# EAGLE schematic T08-TxClicker (EAGLE 6.4)
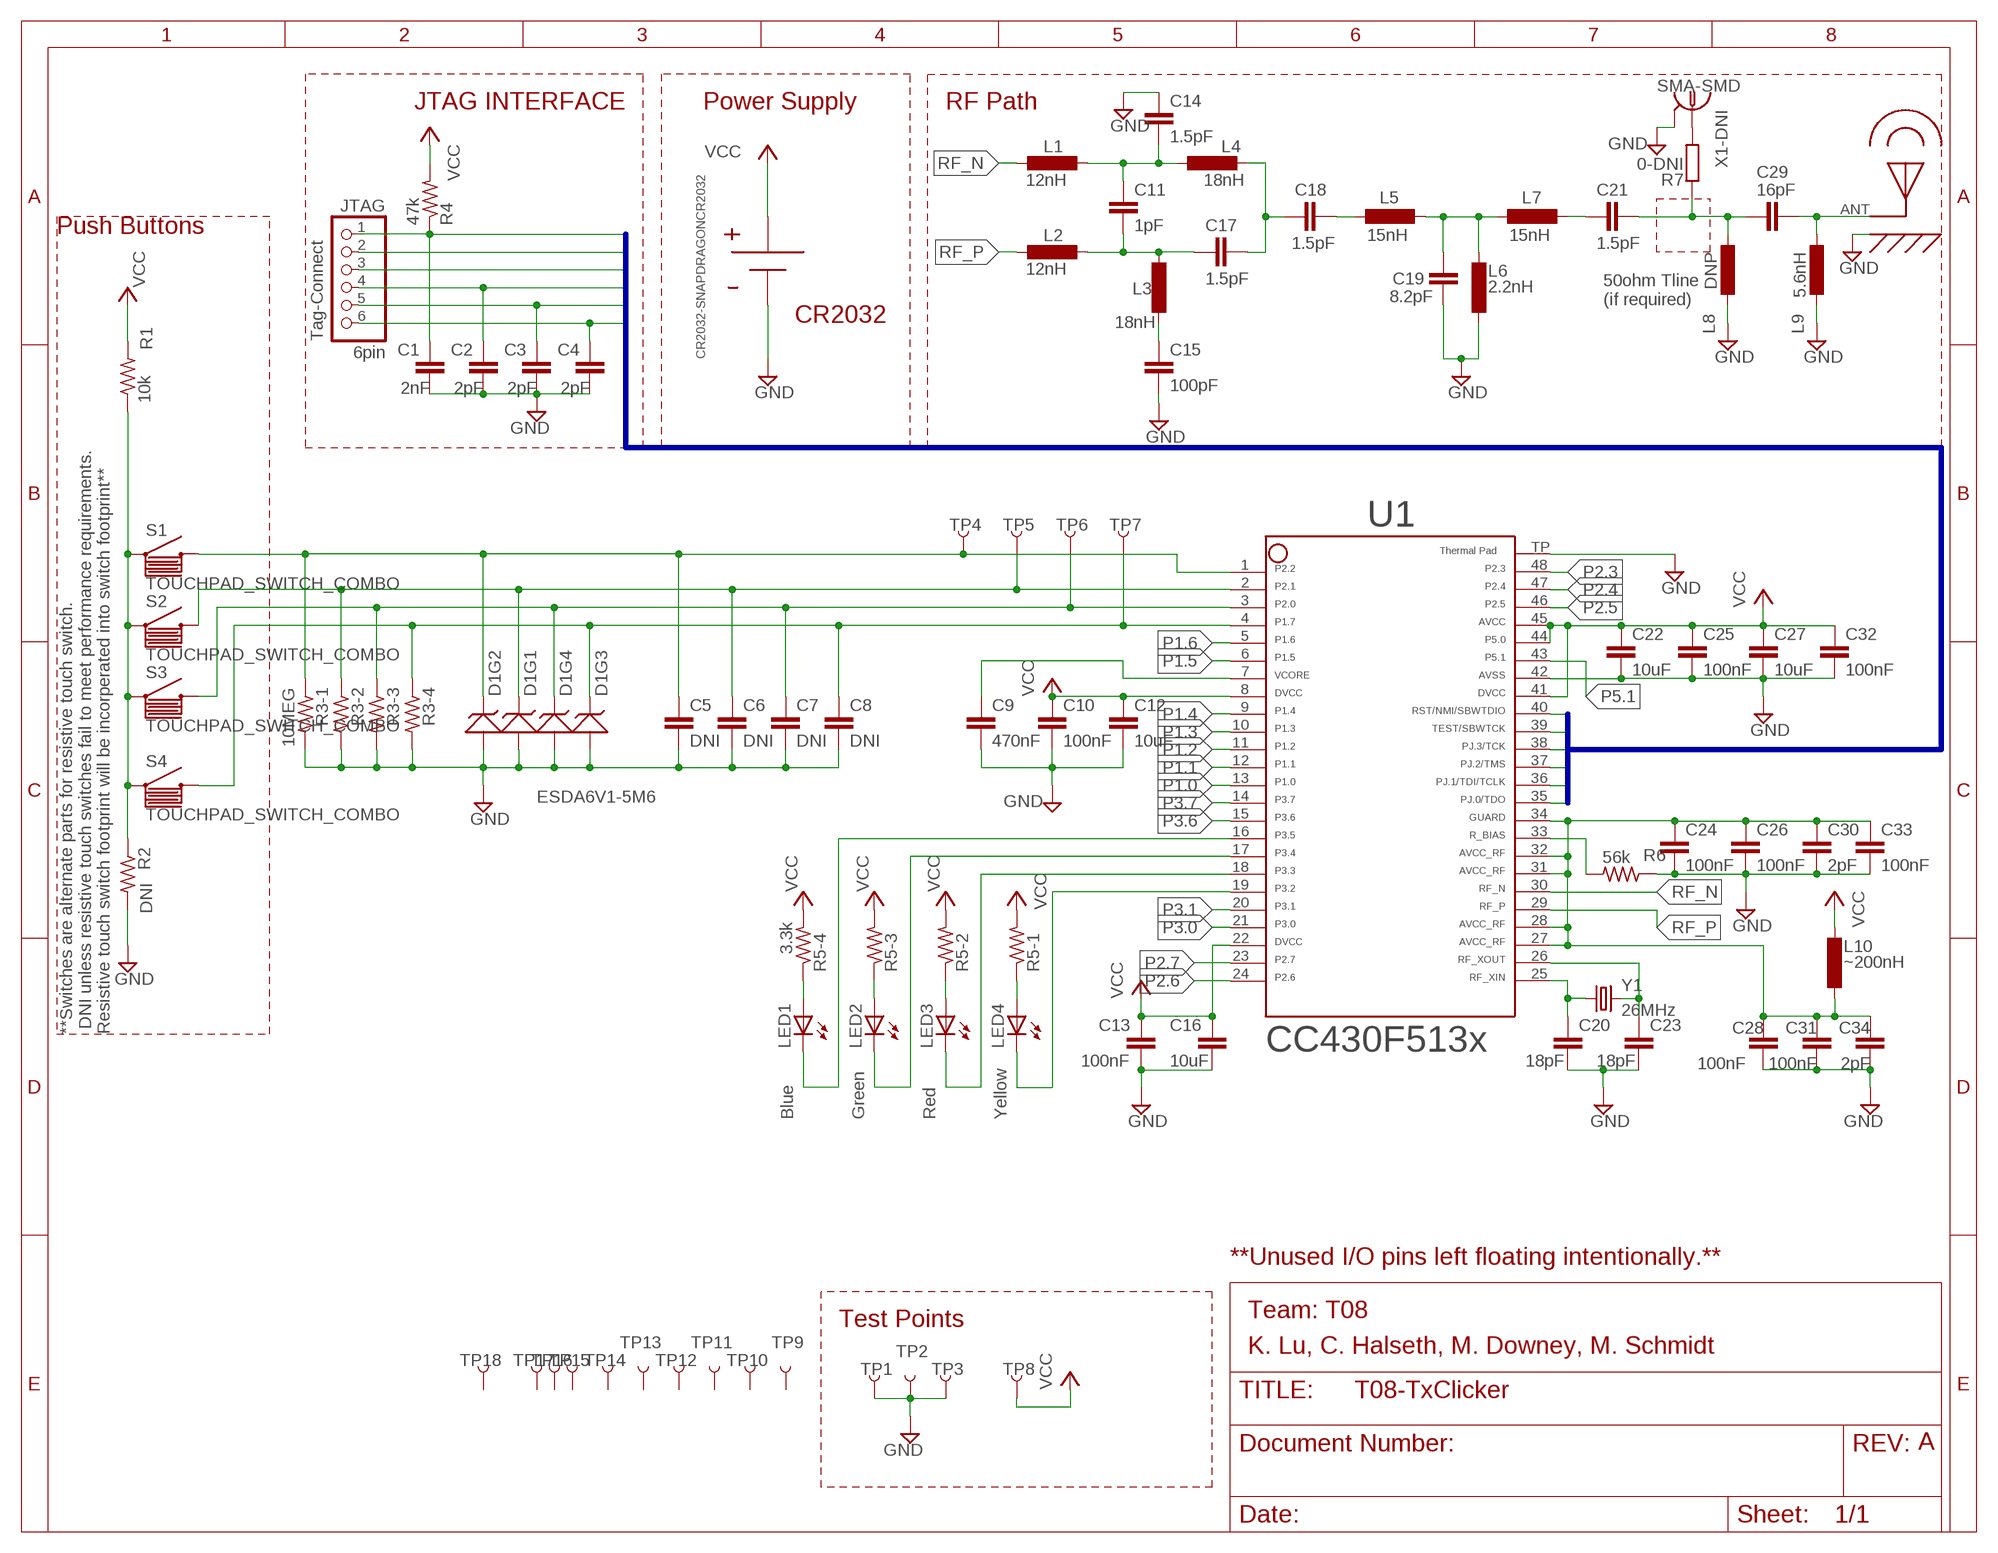
[diagram p0: schematic, sheet 1]

## Parts
C1  2nF  C0603  [C0603]
C2  2pF  C0603  [C0603]
C3  2pF  C0603  [C0603]
C4  2pF  C0603  [C0603]
C5  DNI  C-EUC0603  [C0603]
C6  DNI  C-EUC0603  [C0603]
C7  DNI  C-EUC0603  [C0603]
C8  DNI  C-EUC0603  [C0603]
C9  470nF  C-EUC0603  [C0603]
C10  100nF  C-EUC0603  [C0603]
C11  1pF  C0402  [C0402]
C12  10uF  C-EUC0805  [C0805]
C13  100nF  C-EUC0603  [C0603]
C14  1.5pF  C0402  [C0402]
C15  100pF  C0402  [C0402]
C16  10uF  C-EUC0805  [C0805]
C17  1.5pF  C0402  [C0402]
C18  1.5pF  C0402  [C0402]
C19  8.2pF  C0402  [C0402]
C20  18pF  C-EUC0402  [C0402]
C21  1.5pF  C0402  [C0402]
C22  10uF  C-EUC0805  [C0805]
C23  18pF  C-EUC0402  [C0402]
C24  100nF  C-EUC0603  [C0603]
C25  100nF  C-EUC0603  [C0603]
C26  100nF  C-EUC0603  [C0603]
C27  10uF  C-EUC0805  [C0805]
C28  100nF  C-EUC0603  [C0603]
C29  16pF  C0402  [C0402]
C30  2pF  C-EUC0603  [C0603]
C31  100nF  C-EUC0603  [C0603]
C32  100nF  C-EUC0603  [C0603]
C33  100nF  C-EUC0603  [C0603]
C34  2pF  C-EUC0603  [C0603]
D1  ESDA6V1-5M6  [5X-TVS]
JTAG  6pin  PINHD-1X6  [1X06]
L1  12nH  LL0402  [L0402]
L2  12nH  LL0402  [L0402]
L3  18nH  LL0402  [L0402]
L4  18nH  LL0402  [L0402]
L5  15nH  LL0402  [L0402]
L6  2.2nH  LL0402  [L0402]
L7  15nH  LL0402  [L0402]
L8  DNP  LL0402  [L0402]
L9  5.6nH  LL0402  [L0402]
L10  ~200nH  LL0603  [L0603]
LED1  Blue  LEDCHIP-LED0603  [CHIP-LED0603]
LED2  Green  LEDCHIP-LED0603  [CHIP-LED0603]
LED3  Red  LEDCHIP-LED0603  [CHIP-LED0603]
LED4  Yellow  LEDCHIP-LED0603  [CHIP-LED0603]
R1  10k  R-US_R0603  [R0603]
R2  DNI  R-US_R0603  [R0603]
R3  10MEG  R603X42012  [2012(4_RES)]
R4  47k  R-US_R0603  [R0603]
R5  3.3k  R603X42012  [2012(4_RES)]
R6  56k  R-US_R0603  [R0603]
R7  0-DNI  R0603  [R0603]
S1  TOUCHPAD_SWITCH_COMBO  [TACTILE-PTH-12MM]
S2  TOUCHPAD_SWITCH_COMBO  [TACTILE-PTH-12MM]
S3  TOUCHPAD_SWITCH_COMBO  [TACTILE-PTH-12MM]
S4  TOUCHPAD_SWITCH_COMBO  [TACTILE-PTH-12MM]
TP1  TEST-POINT3  [PAD.03X.03]
TP2  TEST-POINT3  [PAD.03X.03]
TP3  TEST-POINT3  [PAD.03X.03]
TP4  TEST-POINT3  [PAD.03X.03]
TP5  TEST-POINT3  [PAD.03X.03]
TP6  TEST-POINT3  [PAD.03X.03]
TP7  TEST-POINT3  [PAD.03X.03]
TP8  TEST-POINT3  [PAD.03X.03]
TP9  TEST-POINT3  [PAD.03X.03]
TP10  TEST-POINT3  [PAD.03X.03]
TP11  TEST-POINT3  [PAD.03X.03]
TP12  TEST-POINT3  [PAD.03X.03]
TP13  TEST-POINT3  [PAD.03X.03]
TP14  TEST-POINT3  [PAD.03X.03]
TP15  TEST-POINT3  [PAD.03X.03]
TP16  TEST-POINT3  [PAD.03X.03]
TP17  TEST-POINT3  [PAD.03X.03]
TP18  TEST-POINT3  [PAD.03X.03]
U1  CC430F513X---RGZ48  [RGZ48]
U$5  CR2032-SNAPDRAGONCR2032  [CR2032-SNAPDRAGON]
U$6  PCB_ANTENNA_915MHZOSHP  [PCB_ANTENNA_915MHZ]
X1-DNI  SMA-SMD  [SMA-SMD]
Y1  26MHz  CRYSTALTXC-7A  [CRYSTAL-TXC-7A]

## Nets
ANTENNA: C29.P$1 L9.P$2 U$6.ANT
GND: C1.2 C2.2 C3.2 C4.2 C5.2 C6.2 C7.2 C8.2 C9.2 C10.2 C12.2 C13.2 C14.P$1 C15.P$2 C16.2 C19.P$1 C20.2 C22.2 C23.2 C24.2 C25.2 C26.2 C27.2 C28.2 C30.2 C31.2 C32.2 C33.2 C34.2 D1.2 L6.P$2 L8.P$1 L9.P$1 R2.2 R3.2 R3.4 R3.6 R3.8 R6.1 TP1.P$1 TP2.P$1 TP3.P$1 U1.42 U1.TP U$5.V- U$6.GPLANE X1-DNI.2@1 X1-DNI.2@2 X1-DNI.2@3 X1-DNI.2@4 X1-DNI.2@5 X1-DNI.2@6
N$1: C11.P$2 C17.P$2 L2.P$1 L3.P$1
N$2: C11.P$1 C14.P$2 L1.P$1 L4.P$2
N$3: C17.P$1 C18.P$1 L4.P$1
N$4: C15.P$1 L3.P$2
N$5: C18.P$2 L5.P$1
N$6: C19.P$2 L5.P$2 L6.P$1 L7.P$1
N$8: C21.P$2 L7.P$2
N$9: C24.1 C26.1 C28.1 C30.1 C31.1 C33.1 C34.1 L10.2 U1.27 U1.28 U1.31 U1.32 U1.34
N$10: R7.2 X1-DNI.1
N$11: R1.1 R2.1 S1.1 S2.1 S3.1 S4.1
N$12: C21.P$1 C29.P$2 L8.P$2 R7.1
N$13: LED1.A R5.7
N$14: LED2.A R5.5
N$16: LED3.A R5.3
N$17: LED4.A R5.1
P1.0: U1.13
P1.1: U1.12
P1.2: U1.11
P1.3: U1.10
P1.4: U1.9
P1.5: U1.6
P1.6: U1.5
P1.7: C8.1 D1.4 R3.7 S4.3 TP7.P$1 U1.4
P2.0: C7.1 D1.5 R3.5 S3.3 TP6.P$1 U1.3
P2.1: C6.1 D1.1 R3.3 S2.3 TP5.P$1 U1.2
P2.2: C5.1 D1.3 R3.1 S1.3 TP4.P$1 U1.1
P2.3: U1.48
P2.4: U1.47
P2.5: U1.46
P2.6: U1.24
P2.7: U1.23
P3.0: U1.21
P3.1: U1.20
P3.2: LED4.C U1.19
P3.3: LED3.C U1.18
P3.4: LED2.C U1.17
P3.5: LED1.C U1.16
P3.6: U1.15
P3.7: U1.14
P5.1: U1.43
PJ.0/TDO: C4.1 JTAG.6 U1.35
PJ.1/TDI/TCLK: C3.1 JTAG.5 U1.36
PJ.2/TMS: C2.1 JTAG.4 U1.37
PJ.3/TCK: JTAG.3 U1.38
R_BIAS: R6.2 U1.33
RF_N: L1.P$2 U1.30
RF_P: L2.P$2 U1.29
RF_XIN: C20.1 U1.25 Y1.P$1
RF_XOUT: C23.1 U1.26 Y1.P$2
RST/NMI/SBWTDIO: C1.1 JTAG.1 R4.1 U1.40
TEST/SBWTCK: JTAG.2 U1.39
VCC: C10.1 C12.1 C13.1 C16.1 C22.1 C25.1 C27.1 C32.1 L10.1 R1.2 R4.2 R5.2 R5.4 R5.6 R5.8 TP8.P$1 U1.8 U1.22 U1.41 U1.44 U1.45 U$5.V+
VCORE: C9.1 U1.7
Unconnected: D1.6 TP9.P$1 TP10.P$1 TP11.P$1 TP12.P$1 TP13.P$1 TP14.P$1 TP15.P$1 TP16.P$1 TP17.P$1 TP18.P$1

## Buses
PJ.0/TDO,PJ.1/TDI/TCLK,PJ.2/TMS,PJ.3/TCK,TEST/SBWTCK,RST/NMI/SBWTDIO

## Notes on the sheet
- JTAG INTERFACE | Power Supply | RF Path
- Push Buttons
- 50ohm Tline
  (if required)
- CR2032
- Tag-Connect
- **Switches are alternate parts for resistive touch switch.
   DNI unless resistive touch switches fail to meet performance requirements.
  Resistive touch switch footprint will be incorperated into switch footprint**
- **Unused I/O pins left floating intentionally.**
- Team: T08
- Team: T08 | Team: T08 | Team: T08 | Team: T08
- Test Points
- K. Lu, C. Halseth, M. Downey, M. Schmidt
- A

## Library data of the parts
C1-C4 C11 C14 C15 C17-C19 C21 C29 = rcl-amber:C
C5-C10 C12 C13 C16 C20 C22-C28 C30-C34 = rcl:C-EU: CAPACITOR, European symbol
D1 = TVS:ESDA6V1-5M6
JTAG = adafruit:PINHD-1X6: PIN HEADER
L1-L10 = rcl-amber:L
LED1-LED4 = adafruit:LED: LED OSRAM: - CHIPLED LG R971, LG N971, LY N971, LG Q971, LY Q971, LO R971, LY R971 LH N974, LH R974 LS Q976, LO Q976, LY Q976 LO Q996 - Hyper CHIPLED LW Q18S LB Q993, LB Q99A, LB R99A - SideLED LS A670, LO A670, LY A670, LG A670, LP A670 LB A673, LV A673, LT A673, LW A673 LH A674 LY A675 LS A676, LA A676, LO A676, LY A676, LW A676 LS A679, LY A679, LG A679 - Hyper Micro SIDELED® LS Y876, LA Y876, LO Y876, LY Y876 LT Y87S - SmartLED LW L88C, LW L88S LB L89C, LB L89S, LG L890 LS L89K, LO L89K, LY L89K LS L896, LA L896, LO L896, LY L896 - TOPLED LS T670, LO T670, LY T670, LG T670, LP T670 LSG T670, LSP T670, LSY T670, LOP T670, LYG T670 LG T671, LOG T671, LSG T671 LB T673, LV T673, LT T673, LW T673 LH T674 LS T676, LA T676, LO T676, LY T676, LB T676, LH T676, LSB T676, LW T676 LB T67C, LV T67C, LT T67C, LS T67K, LO T67K, LY T67K, LW E67C LS E67B, LA E67B, LO E67B, LY E67B, LB E67C, LV E67C, LT E67C LW T67C LS T679, LY T679, LG T679 LS T770, LO T770, LY T770, LG T770, LP T770 LB T773, LV T773, LT T773, LW T773 LH T774 LS E675, LA E675, LY E675, LS T675 LS T776, LA T776, LO T776, LY T776, LB T776 LHGB T686 LT T68C, LB T68C - Hyper Mini TOPLED® LB M676 - Mini TOPLED Santana® LG M470 LS M47K, LO M47K, LY M47K Source: http://www.osram.convergy.de/
R1 R2 R4 R6 = rcl:R-US_: RESISTOR, American symbol
R3 R5 = QuadResistor:R603X4: Quad resistor package 0603
R7 = rcl-amber:R
S1-S4 = SparkFun-Electromechanical--edited:TOUCHPAD_SWITCH_COMBO: Closed Switch for tutorial schematics. Not intended for PCB design. Maps to 12mm tact switch, only because eagle won't place a part with no package defined. The ordinary SWITCH-MOMENTARY-2 is likely to be more useful for regular schematics.
TP1-TP18 = SparkFun-Passives:TEST-POINT: Bare copper test points for troubleshooting or ICT
U1 = TI_MSP430_v16_truncated:CC430F513X---RGZ48: ***CC430F513X***RGZ48 ** ** Rev 1.0 ** 06/2010 * http://focus.ti.com/docs/prod/folders/print/cc430f5137.html
U$5 = CR2032-SnapDragon:CR2032-SNAPDRAGON: HOLDER SNAP DRAGON CR2032 SMD Digikey P/N: BHSD-2032-SMCT-ND
U$6 = PCB_Antenna_915MHz-halseth:PCB_ANTENNA_915MHZ
X1-DNI = con-coax:SMA-SMD: SMA 50 Ohm Straight Jack Receptacle - Surface Mount www.johnsoncomponents.com Source: http://catalog.digikey.com .. 142-0711-201, 205, 202, 206.pdf; OC_FARNELL: unknown; OC_NEWARK: unknown
Y1 = SparkFun-FreqCtrl:CRYSTAL: Various standard crystals. Proven footprints. Spark Fun Electronics SKU : COM-00534